# EAGLE design Carte du Panier (EAGLE 9.6.2)
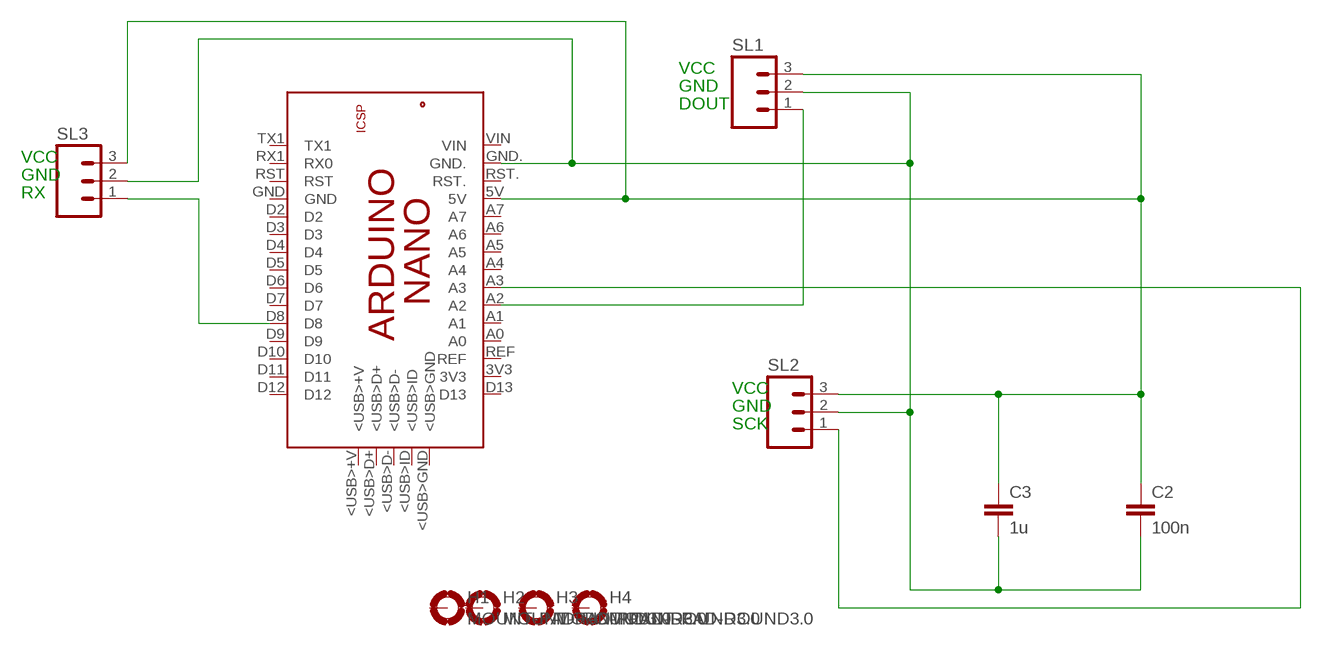
[diagram p0: schematic, sheet 1]

## Parts
C2  100n  C-EU025-024X044  [C025-024X044]
C3  1u  C-EU025-024X044  [C025-024X044]
H1  MOUNT-PAD-ROUND3.0  [3,0-PAD]
H2  MOUNT-PAD-ROUND3.0  [3,0-PAD]
H3  MOUNT-PAD-ROUND3.0  [3,0-PAD]
H4  MOUNT-PAD-ROUND3.0  [3,0-PAD]
PCB1  ARDUINO_NANO  [ARDUINO_NANO]
SL1  M03  [03P]
SL2  M03  [03P]
SL3  M03  [03P]

## Nets
N$2: PCB1.D8 SL3.1
N$4: PCB1.A3 SL2.1
N$5: C2.2 C3.2 PCB1.GND. SL1.2 SL2.2 SL3.2
N$6: C2.1 C3.1 PCB1.5V SL1.3 SL2.3 SL3.3
N$7: PCB1.A2 SL1.1
Unconnected: H1.B3,0(MOUNT) H2.B3,0(MOUNT) H3.B3,0(MOUNT) H4.B3,0(MOUNT) PCB1.3V3 PCB1.5V. PCB1.<USB>+V PCB1.<USB>D+ PCB1.<USB>D- PCB1.<USB>GND PCB1.<USB>ID PCB1.A0 PCB1.A1 PCB1.A4 PCB1.A5 PCB1.A6 PCB1.A7 PCB1.D2 PCB1.D3 PCB1.D4 PCB1.D5 PCB1.D6 PCB1.D7 PCB1.D9 PCB1.D10 PCB1.D11 PCB1.D12 PCB1.D13 PCB1.GND PCB1.GND_ PCB1.MISO PCB1.MOSI PCB1.REF PCB1.RESET.. PCB1.RST PCB1.RST. PCB1.RX1(RX0) PCB1.SCK PCB1.TX1 PCB1.VIN

## Notes on the sheet
- VCC
- GND
- DOUT
- VCC
- GND
- RX
- VCC
- GND
- SCK

## Library data of the parts
C2 C3 = rcl:C-EU: CAPACITOR, European symbol; SPICEPREFIX: C
H1-H4 = holes:MOUNT-PAD-ROUND: MOUNTING PAD, round
PCB1 = E14_Arduino_revC:ARDUINO_NANO: Device for representing an Arduino Nano board with a footprint in an EAGLE design. Created by Dave Young for Element14. More EAGLE documentation at: http://www.element14.com/community/community/knode/cadsoft_eagle
SL1-SL3 = con-amp-quick:M03: AMP QUICK CONNECTOR; OC_FARNELL: unknown; OC_NEWARK: unknown

## Board
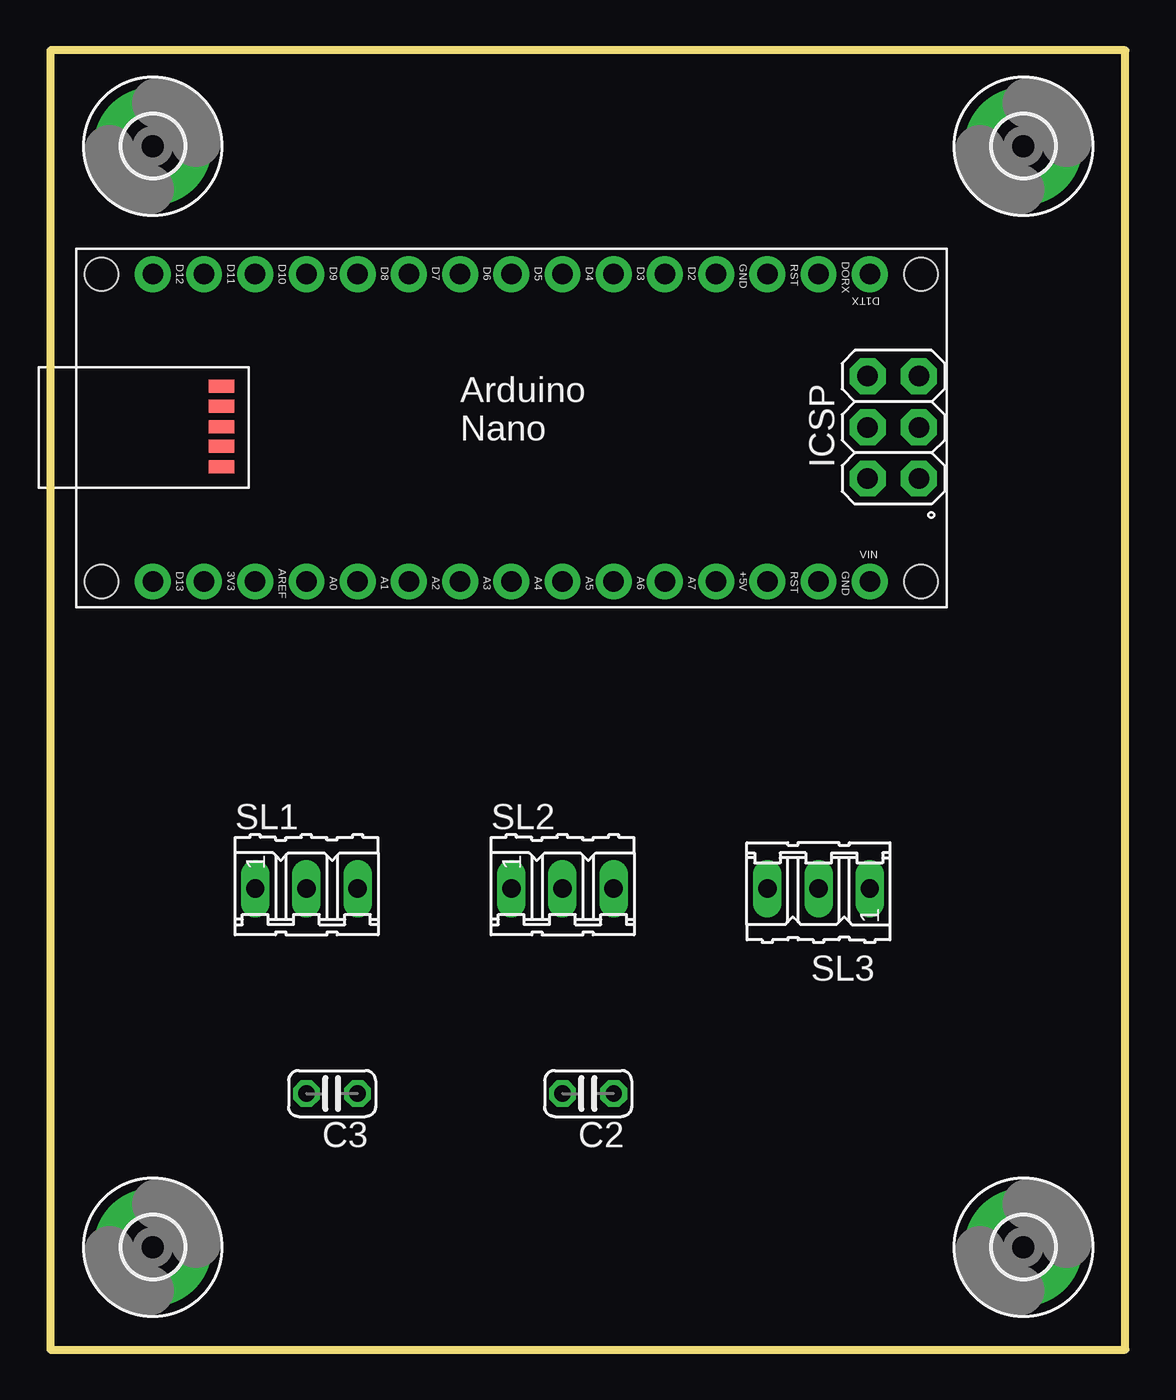
[diagram p1: board, top side]
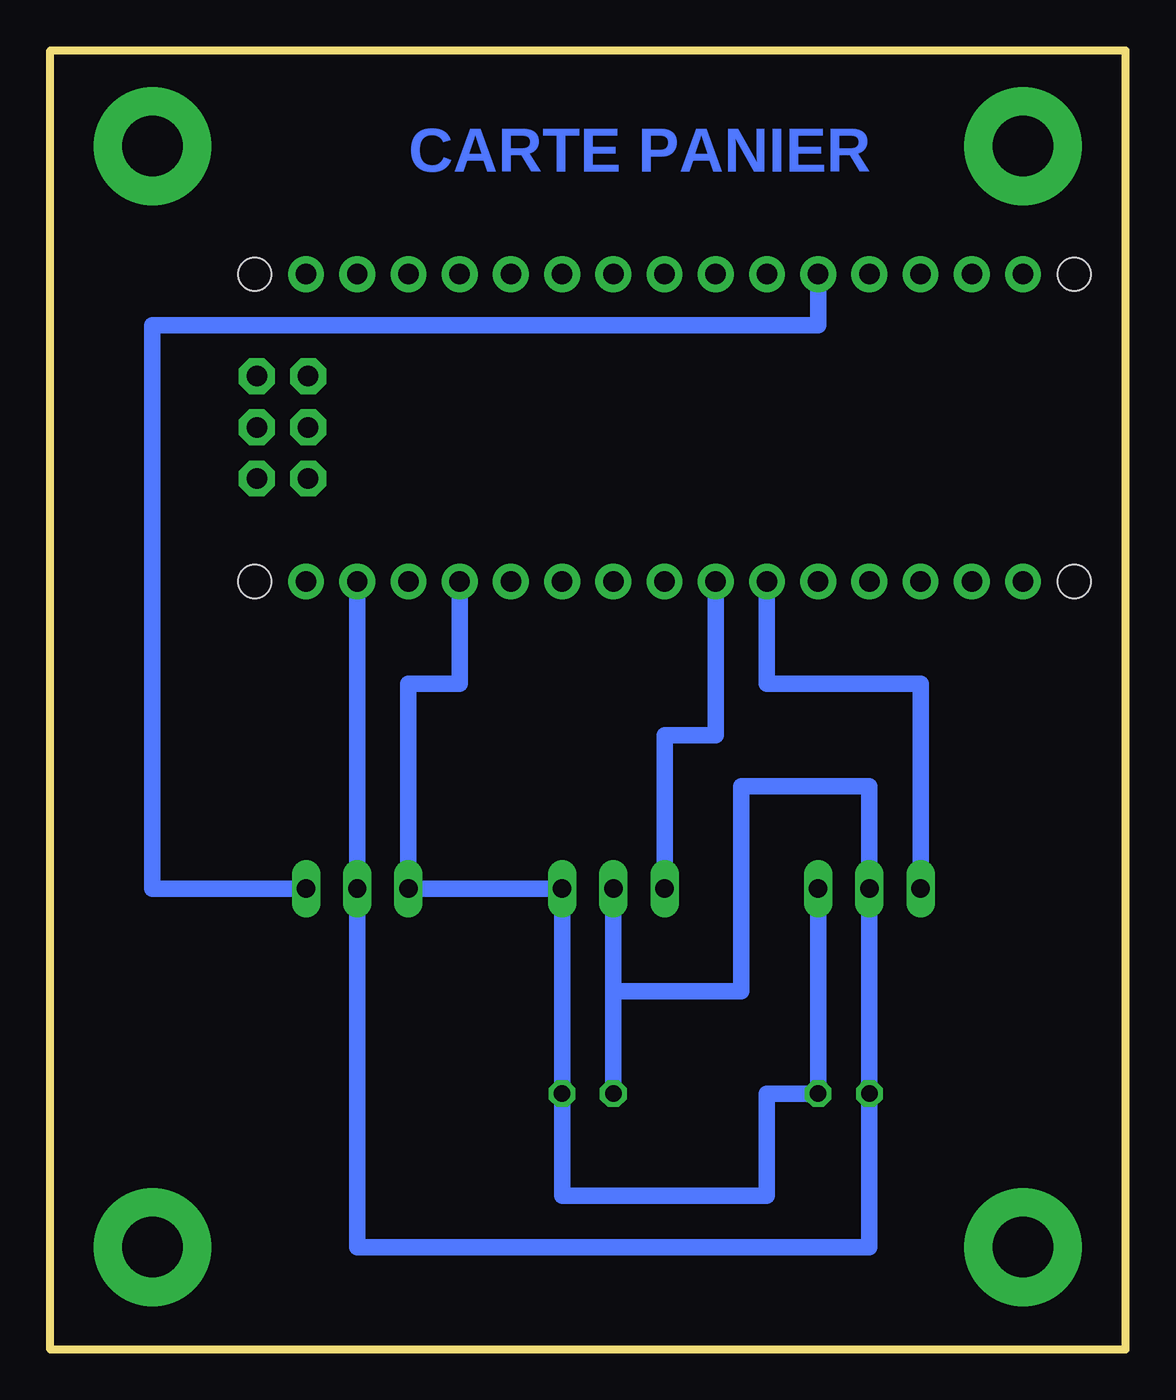
[diagram p2: board, bottom side, seen from below]

Size 53.32 x 64.44 mm. Coordinates in mm from the lower left corner, seen from the top.
Outline: 0,0 53.32,0 53.32,64.44 0,64.44 0,0
Copper layers (1*16): Top 0.035mm / dielectric 0.15mm / Bottom 0.035mm
Design rules "default": minimum track width 6mil, minimum drill 0.35mm, track to track 6mil, track to pad 6mil, pad to pad 6mil, via to via 6mil, smd to smd 6mil, copper to edge 40mil, drill to drill 6mil, minimum pad ring 10mil, minimum via ring 8mil, stop-mask expansion 4mil, vias tented up to drill 0mil, thermal gap 10mil

### Footprints (pad centres in the part's own frame; a part is rotated, then mirrored left to right if it is on the bottom)
C025-024X044 = drill 0.813 octagon: 1 -1.27,0; 2 1.27,0
3,0-PAD = drill 3 pad 5.842: B3,0 0,0
ARDUINO_NANO = drill 1.016 pad 1.778: 3V3 6.35,1.27; 5V 31.75,1.27; A0 11.43,1.27; A1 13.97,1.27; A2 16.51,1.27; A3 19.05,1.27; A4 21.59,1.27; A5 24.13,1.27; A6 26.67,1.27; A7 29.21,1.27; D2 29.21,16.51; D3 26.67,16.51; D4 24.13,16.51; D5 21.59,16.51; D6 19.05,16.51; D7 16.51,16.51; D8 13.97,16.51; D9 11.43,16.51; D10 8.89,16.51; D11 6.35,16.51; D12 3.81,16.51; D13 3.81,1.27; GND 31.75,16.51; GND. 36.83,1.27; REF 8.89,1.27; RST 34.29,16.51; RST. 34.29,1.27; RX1 36.83,16.51; TX1 39.37,16.51; VIN 39.37,1.27 | drill 1.016 pad 1.778 octagon: 5V. 39.268,6.375; GND_ 39.268,11.455; MISO 41.808,6.375; MOSI 39.268,8.915; RESET.. 41.808,11.455; SCK 41.808,8.915 | smd 1.27 x 0.635: <USB>+V 7.214,10.947; <USB>D+ 7.214,9.957; <USB>D- 7.214,8.941; <USB>GND 7.214,6.96; <USB>ID 7.214,7.976 | hole 1.651: 1.27,1.27; 1.27,16.51; 41.91,16.51; 41.91,1.27
03P = drill 0.914 long: 1 -2.54,0; 2 0,0; 3 2.54,0

### Placement (x,y rotation side)
C2  26.67,12.7 180 top
C3  13.97,12.7 180 top
H1  5.08,59.69 0 top
H2  48.26,59.69 0 top
H3  5.08,5.08 0 top
H4  48.26,5.08 0 top
PCB1  1.27,36.83 0 top
SL1  12.7,22.86 0 top
SL2  25.4,22.86 0 top
SL3  38.1,22.86 180 top

### Tracks (layer width: path | path; a pad name or v marks a point on that pad's centre or on a via)
N$2
  Bottom 0.813: PCB1.D8 15.24,50.8 48.26,50.8 48.26,22.86 SL3.1
N$4
  Bottom 0.813: PCB1.A3 20.32,30.48 22.86,30.48 SL2.1
N$5
  Bottom 0.813: PCB1.GND. SL3.2 38.1,5.08 12.7,5.08 C3.2 SL1.2 12.7,27.94 19.05,27.94 19.05,17.78 25.4,17.78 | SL2.2 25.4,17.78 | C2.2 25.4,17.78
N$6
  Bottom 0.813: SL1.3 C3.1 17.78,12.7 17.78,7.62 27.94,7.62 C2.1 SL2.3 SL3.3 35.56,33.02 33.02,33.02 PCB1.5V
N$7
  Bottom 0.813: SL1.1 10.16,33.02 17.78,33.02 PCB1.A2

### Text on the board
Bottom: CARTE PANIER